# Altium project Tube02.PrjPCB
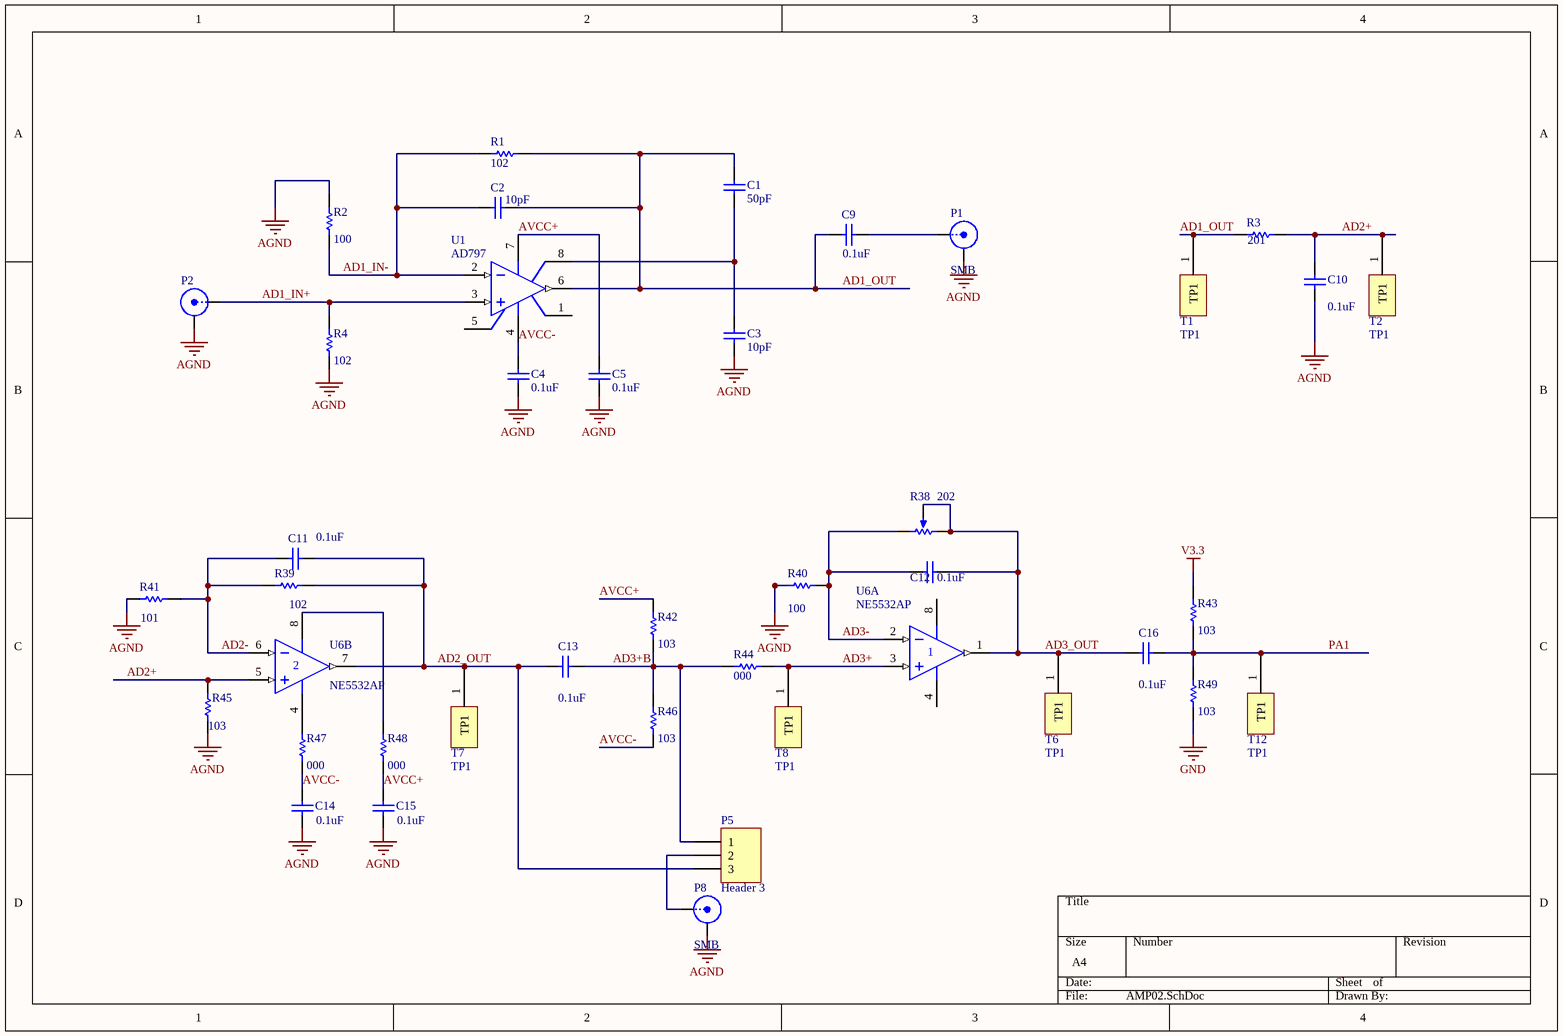
[diagram p0: AMP02.SchDoc]
4 sheets, 102 parts. Net scope: global (net labels, ports and power ports of the same name join across sheets).
Board file: Tube02.PcbDoc
Sheets:
  AMP02.SchDoc
  Commu02.SchDoc
  MCU02.SchDoc
  Power02.SchDoc

## Sheet AMP02.SchDoc
size A4

### Parts
C1  value 50pF  [1206]  (hidden comment: Cap Semi)
C2  value 10pF  [1206]  (hidden comment: Cap Semi)
C3  value 10pF  [1206]  (hidden comment: Cap Semi)
C4  value 0.1uF  [1206]  (hidden comment: Cap Semi)
C5  value 0.1uF  [1206]  (hidden comment: Cap Semi)
C9  value 0.1uF  [1206]  (hidden comment: Cap Semi)
C10  value 0.1uF  [1206]  (hidden comment: Cap Semi)
C11  value 0.1uF  [1206]  (hidden comment: Cap Semi)
C12  value 0.1uF  [1206]  (hidden comment: Cap Semi)
C13  value 0.1uF  [1206]  (hidden comment: Cap Semi)
C14  value 0.1uF  [1206]  (hidden comment: Cap Semi)
C15  value 0.1uF  [1206]  (hidden comment: Cap Semi)
C16  value 0.1uF  [1206]  (hidden comment: Cap Semi)
P1  SMB  [SMB_V-RJ45]
P2  SMB  [SMB_V-RJ45]  (value not drawn)
P5  Header 3  [HDR1X3]
P8  SMB  [SMB_V-RJ45]
R1  value 102  [1206]  (hidden comment: Res Semi)
R2  value 100  [1206]  (hidden comment: Res Semi)
R3  value 201  [1206]  (hidden comment: Res Semi)
R4  value 102  [1206]  (hidden comment: Res Semi)
R38  value 202  [VR5]  (hidden comment: RPot)
R39  value 102  [1206]  (hidden comment: Res Semi)
R40  value 100  [1206]  (hidden comment: Res Semi)
R41  value 101  [1206]  (hidden comment: Res Semi)
R42  value 103  [1206]  (hidden comment: Res Semi)
R43  value 103  [1206]  (hidden comment: Res Semi)
R44  value 000  [1206]  (hidden comment: Res Semi)
R45  value 103  [1206]  (hidden comment: Res Semi)
R46  value 103  [1206]  (hidden comment: Res Semi)
R47  value 000  [1206]  (hidden comment: Res Semi)
R48  value 000  [1206]  (hidden comment: Res Semi)
R49  value 103  [1206]  (hidden comment: Res Semi)
T1  TP1  [TP1]
T2  TP1  [TP1]
T6  TP1  [TP1]
T7  TP1  [TP1]
T8  TP1  [TP1]
T12  TP1  [TP1]
U1  AD797  [SO-8C_M]
U6  NE5532AP  [SO-8C_M]  (parts A,B of 2)

### Nets
AGND: C3.1 C4.1 C5.1 C10.1 C14.1 C15.1 P1.2(Y) P2.2(Y) P8.2(Y) R2.2 R4.1 R40.1 R41.1 R45.1
GND: R49.1
V3.3: R43.2
AD1_IN+: P2.1(X) R4.2 U1.3(IN+)
AD1_IN-: C2.1 R1.2 R2.1 U1.2(IN-)
AD1_OUT: C1.2 C2.2 C9.1 R1.1 R3.1 T1.1(TP1) U1.6(OUT)
AD2+: C10.2 R3.2 R45.2 T2.1(TP1) U6.5(IN+)
AD2-: C11.1 R39.1 R41.2 U6.6(IN-)
AD2_OUT: C11.2 C13.1 P5.3 R39.2 T7.1(TP1) U6.7(OUT)
AD3+: R44.1 T8.1(TP1) U6.3(IN+)
AD3+B: C13.2 P5.1 R42.1 R44.2 R46.2
AD3-: C12.1 R38.2(BOT) R40.2 U6.2(IN-)
AD3_OUT: C12.2 C16.1 R38.1(TOP) R38.3(TAP) T6.1(TP1) U6.1(OUT)
AVCC+: C5.2 C15.2 R42.2 R48.1 U1.7(V+)
AVCC-: C4.2 C14.2 R46.1 R47.1 U1.4(V-)
PA1: C16.2 R43.1 R49.2 T12.1(TP1)
NetC1_1: C1.1 C3.2 U1.8(DECMPEN)
NetC9_2: C9.2 P1.1(X)
NetP5_2: P5.2 P8.1(X)
NetR47_2: R47.2 U6.4(V-)
NetR48_2: R48.2 U6.8(V+)

Not connected (* = marked no-connect by the designer): U1 1(OS_NUL) 5(OS_NUL)

### Library data of the parts
C1-C5 C9-C16 = Cap Semi: Capacitor (Semiconductor SIM Model); Published: 8-Jun-2000; LatestRevisionDate: 29-May-2009; LatestRevisionNote: IPC-7351 Footprint Added.; PackageReference: C1206; Publisher: Altium Limited; PackageDescription: Chip Capacitor
P1 P2 P8 = SMB: SMB Straight Connector; LatestRevisionDate: 17-Jul-2002; LatestRevisionNote: Re-released for DXP Platform.; Publisher: Altium Limited
P5 = Header 3: Header, 3-Pin; LatestRevisionDate: 17-Jul-2002; LatestRevisionNote: Re-released for DXP Platform.; Publisher: Altium Limited
R1-R4 R39-R49 = Res Semi: Semiconductor Resistor; Published: 8-Jun-2000; LatestRevisionDate: 17-Jul-2002; LatestRevisionNote: Re-released for DXP Platform.; PackageReference: AXIAL-0.5; Publisher: Altium Limited
R38 = RPot: Potentiometer; Sim Note: Enter the Resistance value and the set point into parameter fields.; Set Position: 0.5; Published: 8-Jun-2000; LatestRevisionDate: 17-Jul-2002; LatestRevisionNote: Re-released for DXP Platform.; PackageReference: VR5; Publisher: Altium Limited
U1 = AD797AR: Ultra-Low Distortion, Ultra-Low Noise Operational Amplifier; Published: 8-Jun-2000; LatestRevisionDate: 13-Apr-2006; LatestRevisionNote: IPC-7351 Footprint Added.; DatasheetVersion: REV. C; PackageVersion: revC; PackageReference: SO-8C; Publisher: Altium Limited; PackageDescription: 8-Pin Small Outline Integrated Circuit 1.27 mm Pitch; Code_IPC: SOIC127P600-8; ComponentLink1Description: Manufacturer Link; ComponentLink1URL: http://www.analog.com/en/prod/0,,759_786_AD797%2C00.html; ComponentLink2Description: Datasheet; ComponentLink2URL: http://www.analog.com/UploadedFiles/Data_Sheets/507345751AD797_d.pdf
U6 = NE5532AP: Dual Low-Noise Operational Amplifier; Published: 15-Apr-2002; LatestRevisionDate: 04-Mar-2005; LatestRevisionNote: Stylized 3D Model Added.; DatasheetVersion: May-1988; PackageVersion: Jun-1999; PackageReference: P008; Publisher: Altium Limited; PackageDescription: DIP; 8 Leads; Row Spacing 7.62 mm; Pitch 2.54 mm; Code_JEDEC: MO-001-AN; ComponentLink1Description: Manufacturer Link; ComponentLink1URL: http://www.ti.com/; ComponentLink2Description: Datasheet; ComponentLink2URL: http://www-s.ti.com/sc/ds/ne5532a.pdf

## Sheet Commu02.SchDoc
size A4
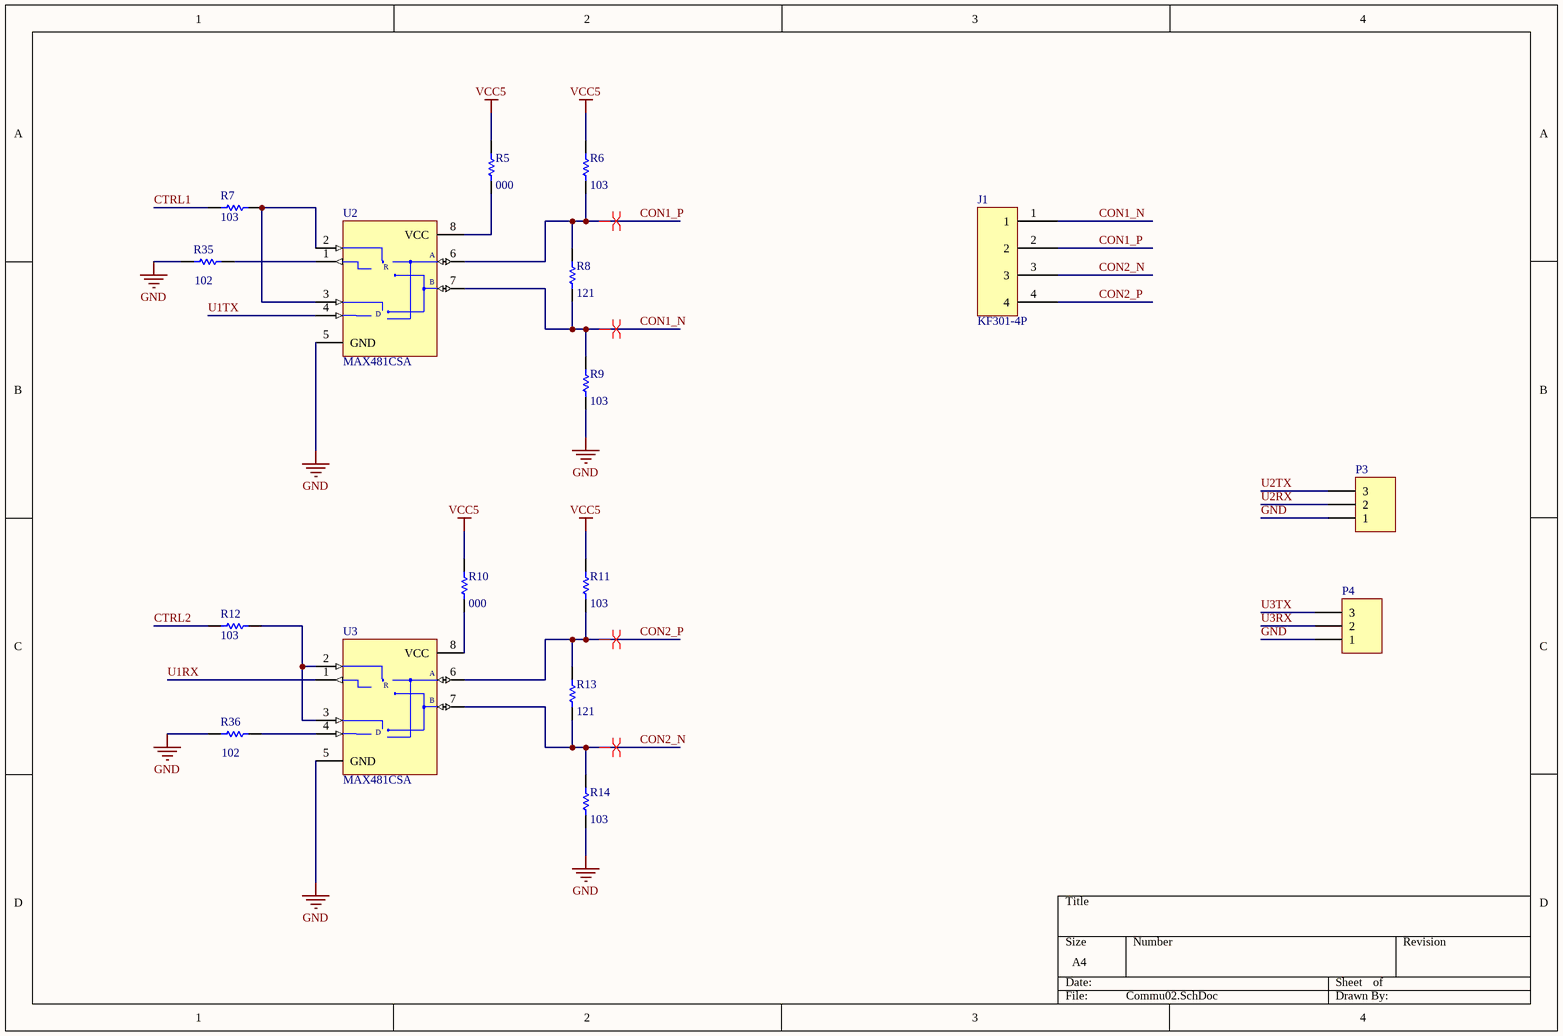
[diagram p1: Commu02.SchDoc]

### Parts
J1  KF301-4P  [KF301-4P]
P3  Header 3  [HDR1X3]  (value not drawn)
P4  Header 3  [HDR1X3]  (value not drawn)
R5  value 000  [1206]  (hidden comment: Res Semi)
R6  value 103  [1206]  (hidden comment: Res Semi)
R7  value 103  [1206]  (hidden comment: Res Semi)
R8  value 121  [1206]  (hidden comment: Res Semi)
R9  value 103  [1206]  (hidden comment: Res Semi)
R10  value 000  [1206]  (hidden comment: Res Semi)
R11  value 103  [1206]  (hidden comment: Res Semi)
R12  value 103  [1206]  (hidden comment: Res Semi)
R13  value 121  [1206]  (hidden comment: Res Semi)
R14  value 103  [1206]  (hidden comment: Res Semi)
R35  value 102  [1206]  (hidden comment: Res Semi)
R36  value 102  [1206]  (hidden comment: Res Semi)
U2  MAX481CSA  [NSO8_M]
U3  MAX481CSA  [NSO8_M]

### Nets
GND: P3.1 P4.1 R9.1 R14.1 R35.2 R36.2 U2.5(GND) U3.5(GND)
VCC5: R5.2 R6.2 R10.2 R11.2
CON1_N: J1.1 R8.1 R9.2 U2.7(B)
CON1_P: J1.2 R6.1 R8.2 U2.6(A)
CON2_N: J1.3 R13.1 R14.2 U3.7(B)
CON2_P: J1.4 R11.1 R13.2 U3.6(A)
CTRL1: R7.2
CTRL2: R12.2
U1RX: U3.1(RO)
U1TX: U2.4(DI)
U2RX: P3.2
U2TX: P3.3
U3RX: P4.2
U3TX: P4.3
NetR5_1: R5.1 U2.8(VCC)
NetR7_1: R7.1 U2.2(~{RE}) U2.3(DE)
NetR10_1: R10.1 U3.8(VCC)
NetR12_1: R12.1 U3.2(~{RE}) U3.3(DE)
NetR35_1: R35.1 U2.1(RO)
NetR36_1: R36.1 U3.4(DI)

### Layout directives
differential pair: CON1_N, CON1_P, CON2_N, CON2_P

### Notes on the sheet
- (in symbol MAX481CSA) R; D

### Library data of the parts
P3 P4 = Header 3: Header, 3-Pin; LatestRevisionDate: 17-Jul-2002; LatestRevisionNote: Re-released for DXP Platform.; Publisher: Altium Limited
R5-R14 R35 R36 = Res Semi: Semiconductor Resistor; Published: 8-Jun-2000; LatestRevisionDate: 17-Jul-2002; LatestRevisionNote: Re-released for DXP Platform.; PackageReference: AXIAL-0.5; Publisher: Altium Limited
U2 U3 = MAX481CSA: Low-Power, Slew-Rate-Limited RS-485/RS-422 Transceiver; Published: 16-Jan-2001; LatestRevisionDate: 13-Apr-2006; LatestRevisionNote: IPC-7351 Footprint Added.; DatasheetVersion: Feb-1996; PackageReference: NSO8; Publisher: Altium Limited; PackageDescription: 8-Pin Small Outline Integrated Circuit 1.27 mm Pitch; Code_JEDEC: MS-012-AA; Code_IPC: SOIC127P600-8; ComponentLink1Description: Manufacturer Link; ComponentLink1URL: http://www.maxim-ic.com/; ComponentLink2Description: Datasheet; ComponentLink2URL: http://pdfserv.maxim-ic.com/en/ds/MAX1487-MAX491.pdf

## Sheet MCU02.SchDoc
size A4
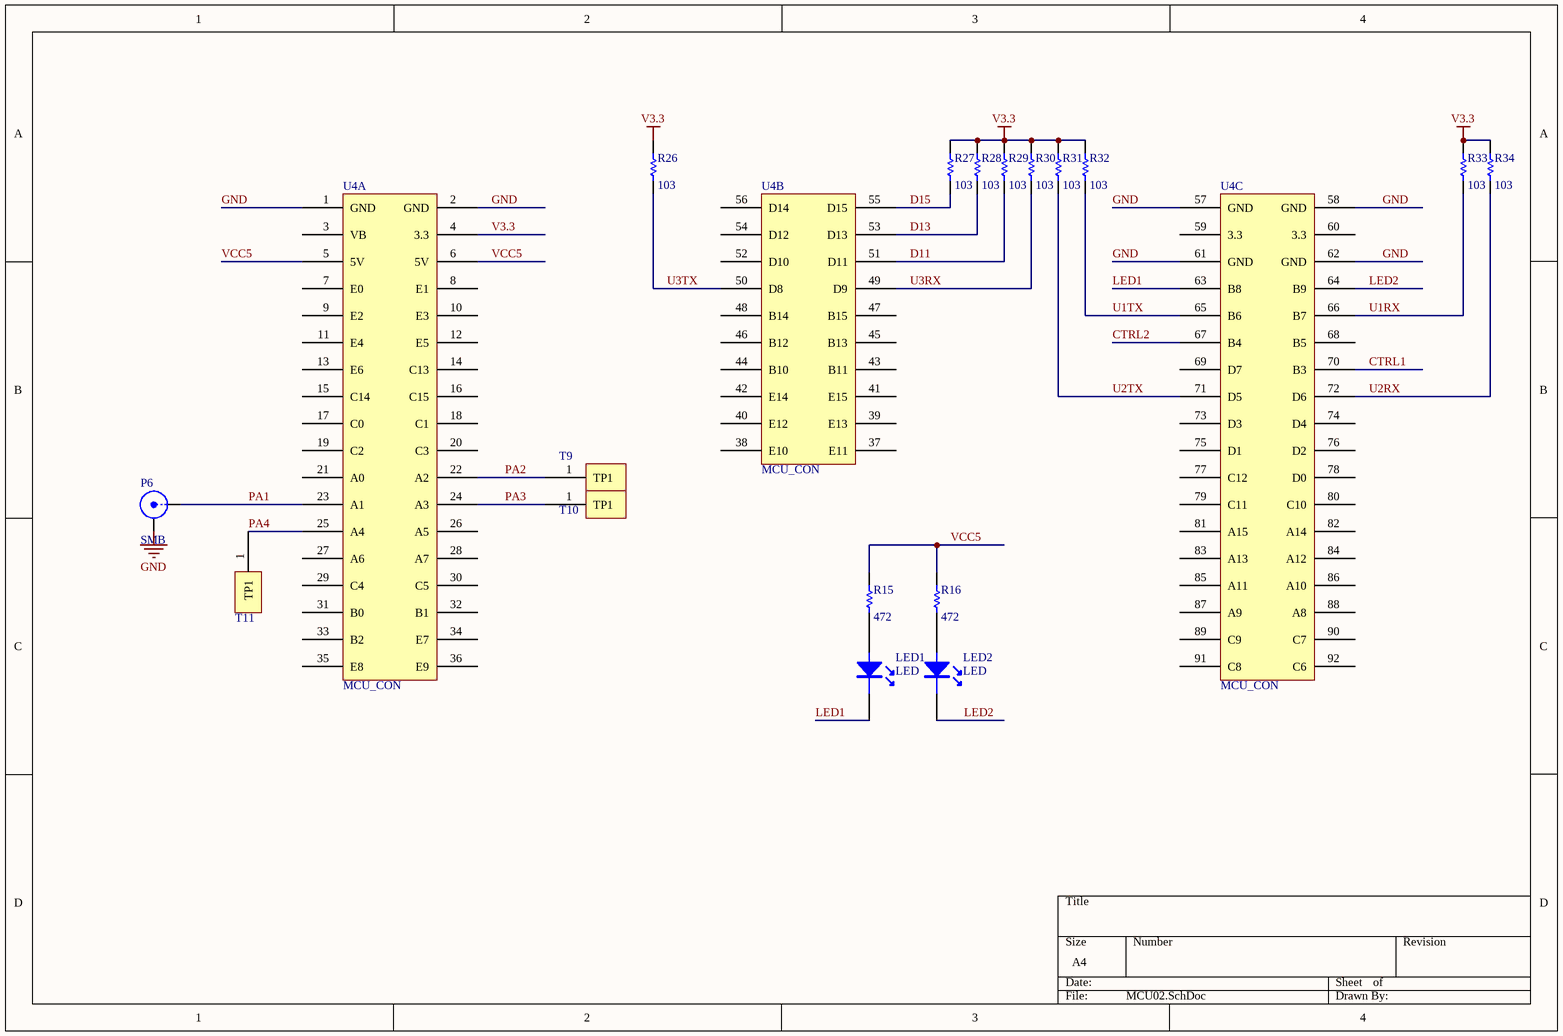
[diagram p2: MCU02.SchDoc]

### Parts
LED1  LED  [0805_LED]
LED2  LED  [0805_LED]
P6  SMB  [SMB_V-RJ45]
R15  value 472  [1206]  (hidden comment: Res Semi)
R16  value 472  [1206]  (hidden comment: Res Semi)
R26  value 103  [1206]  (hidden comment: Res Semi)
R27  value 103  [1206]  (hidden comment: Res Semi)
R28  value 103  [1206]  (hidden comment: Res Semi)
R29  value 103  [1206]  (hidden comment: Res Semi)
R30  value 103  [1206]  (hidden comment: Res Semi)
R31  value 103  [1206]  (hidden comment: Res Semi)
R32  value 103  [1206]  (hidden comment: Res Semi)
R33  value 103  [1206]  (hidden comment: Res Semi)
R34  value 103  [1206]  (hidden comment: Res Semi)
T9  TP1  [TP1]  (value not drawn)
T10  TP1  [TP1]  (value not drawn)
T11  TP1  [TP1]  (value not drawn)
U4  MCU_CON  [MCU_CON]  (parts A,B,C of 3)

### Nets
GND: P6.2(Y) U4.1(GND) U4.2(GND) U4.57(GND) U4.58(GND) U4.61(GND) U4.62(GND)
V3.3: R26.2 R27.2 R28.2 R29.2 R30.2 R31.2 R32.2 R33.2 R34.2 U4.4(3.3)
VCC5: R15.2 R16.2 U4.5(5V) U4.6(5V)
CTRL1: U4.70(B3)
CTRL2: U4.67(B4)
D11: R29.1 U4.51(D11)
D13: R28.1 U4.53(D13)
D15: R27.1 U4.55(D15)
LED1: LED1.2(K) U4.63(B8)
LED2: LED2.2(K) U4.64(B9)
PA1: P6.1(X) U4.23(A1)
PA2: T9.1(TP1) U4.22(A2)
PA3: T10.1(TP1) U4.24(A3)
PA4: T11.1(TP1) U4.25(A4)
U1RX: R33.1 U4.66(B7)
U1TX: R32.1 U4.65(B6)
U2RX: R34.1 U4.72(D6)
U2TX: R31.1 U4.71(D5)
U3RX: R30.1 U4.49(D9)
U3TX: R26.1 U4.50(D8)
NetLED1_1: LED1.1(A) R15.1
NetLED2_1: LED2.1(A) R16.1

Not connected (* = marked no-connect by the designer): U4 3(VB) 7(E0) 8(E1) 9(E2) 10(E3) 11(E4) 12(E5) 13(E6) 14(C13) 15(C14) 16(C15) 17(C0) 18(C1) 19(C2) 20(C3) 21(A0) 26(A5) 27(A6) 28(A7) 29(C4) 30(C5) 31(B0) 32(B1) 33(B2) 34(E7) 35(E8) 36(E9) 37(E11) 38(E10) 39(E13) 40(E12) 41(E15) 42(E14) 43(B11) 44(B10) 45(B13) 46(B12) 47(B15) 48(B14) 52(D10) 54(D12) 56(D14) 59(3.3) 60(3.3) 68(B5) 69(D7) 73(D3) 74(D4) 75(D1) 76(D2) 77(C12) 78(D0) 79(C11) 80(C10) 81(A15) 82(A14) 83(A13) 84(A12) 85(A11) 86(A10) 87(A9) 88(A8) 89(C9) 90(C7) 91(C8) 92(C6)

### Library data of the parts
P6 = SMB: SMB Straight Connector; LatestRevisionDate: 17-Jul-2002; LatestRevisionNote: Re-released for DXP Platform.; Publisher: Altium Limited
R15 R16 R26-R34 = Res Semi: Semiconductor Resistor; Published: 8-Jun-2000; LatestRevisionDate: 17-Jul-2002; LatestRevisionNote: Re-released for DXP Platform.; PackageReference: AXIAL-0.5; Publisher: Altium Limited

## Sheet Power02.SchDoc
size A4
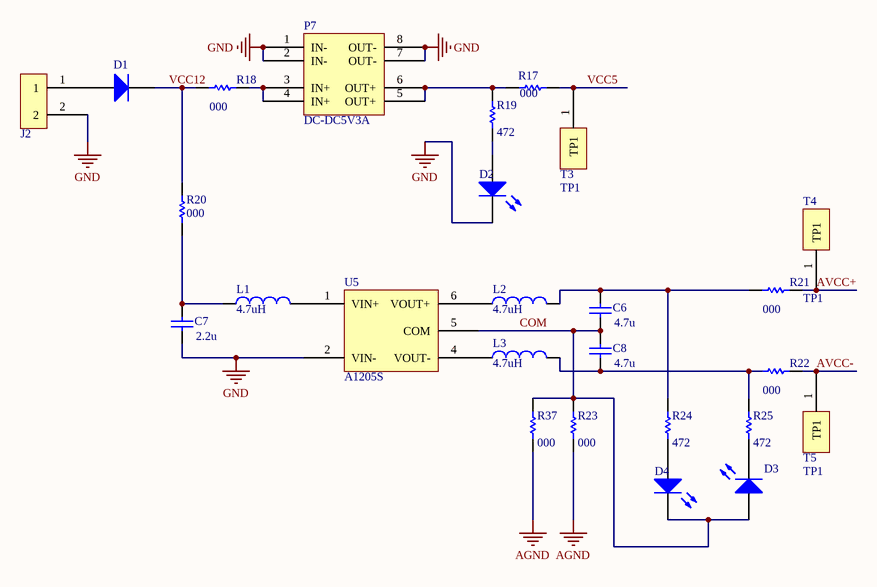
[diagram p3: Power02.SchDoc]

### Parts
C6  value 4.7u  [1206]  (hidden comment: Cap Semi)
C7  value 2.2u  [1206]  (hidden comment: Cap Semi)
C8  value 4.7u  [1206]  (hidden comment: Cap Semi)
D1  LED2  [0805_LED]  (value not drawn)
D2  LED2  [0805_LED]  (value not drawn)
D3  LED2  [0805_LED]  (value not drawn)
D4  LED2  [0805_LED]  (value not drawn)
J2  XK7.62-2P  [XK7.62-2P]  (value not drawn)
L1  value 4.7uH  [1206]  (hidden comment: Inductor)
L2  value 4.7uH  [1206]  (hidden comment: Inductor)
L3  value 4.7uH  [1206]  (hidden comment: Inductor)
P7  DC-DC5V3A  [DC-DC3A]
R17  value 000  [1206]  (hidden comment: Res Semi)
R18  value 000  [1206]  (hidden comment: Res Semi)
R19  value 472  [1206]  (hidden comment: Res Semi)
R20  value 000  [1206]  (hidden comment: Res Semi)
R21  value 000  [1206]  (hidden comment: Res Semi)
R22  value 000  [1206]  (hidden comment: Res Semi)
R23  value 000  [1206]  (hidden comment: Res Semi)
R24  value 472  [1206]  (hidden comment: Res Semi)
R25  value 472  [1206]  (hidden comment: Res Semi)
R37  value 000  [1206]  (hidden comment: Res Semi)
T3  TP1  [TP1]
T4  TP1  [TP1]
T5  TP1  [TP1]
U5  A1205S  [A1205S]

### Nets
AGND: R23.1 R37.1
GND: C7.1 D2.2(K) J2.2 P7.1(IN-) P7.2(IN-) P7.7(OUT-) P7.8(OUT-) U5.2(VIN-)
VCC5: R17.2 T3.1(TP1)
AVCC+: R21.2 T4.1(TP1)
AVCC-: R22.2 T5.1(TP1)
COM: C6.1 C8.2 D3.1(A) D4.2(K) R23.2 R37.2 U5.5(COM)
VCC12: D1.2(K) R18.1 R20.2
NetC6_2: C6.2 L2.2 R21.1 R24.2
NetC7_2: C7.2 L1.1 R20.1
NetC8_1: C8.1 L3.2 R22.1 R25.2
NetD1_1: D1.1(A) J2.1
NetD2_1: D2.1(A) R19.1
NetD3_2: D3.2(K) R25.1
NetD4_1: D4.1(A) R24.1
NetL1_2: L1.2 U5.1(VIN+)
NetL2_1: L2.1 U5.6(VOUT+)
NetL3_1: L3.1 U5.4(VOUT-)
NetP7_3: P7.3(IN+) P7.4(IN+) R18.2
NetP7_5: P7.5(OUT+) P7.6(OUT+) R17.1 R19.2

### Library data of the parts
C6-C8 = Cap Semi: Capacitor (Semiconductor SIM Model); Published: 8-Jun-2000; LatestRevisionDate: 29-May-2009; LatestRevisionNote: IPC-7351 Footprint Added.; PackageReference: C1206; Publisher: Altium Limited; PackageDescription: Chip Capacitor
D1 = Diode 1N4001: 1 Amp General Purpose Rectifier; Published: 8-Jun-2000; LatestRevisionDate: 17-Jul-2002; LatestRevisionNote: Re-released for DXP Platform.; DatasheetVersion: 1998; PackageVersion: Aug-1999; PackageReference: DO-41; Publisher: Altium Limited; Code_JEDEC: DO-204-AL; ComponentLink1Description: Manufacturer Link; ComponentLink1URL: http://www.fairchildsemi.com/; ComponentLink2Description: Datasheet; ComponentLink2URL: http://www.fairchildsemi.com/ds/1N%2F1N4001.pdf
D2-D4 = LED2: Typical RED, GREEN, YELLOW, AMBER GaAs LED; Published: 8-Jun-2000; LatestRevisionDate: 17-Jul-2002; LatestRevisionNote: Re-released for DXP Platform.; PackageVersion: Feb-2002; PackageReference: 3.2X1.6X1.1; Publisher: Altium Limited
L1-L3 = Inductor: Code_IEC: 1005; Published: 8-Jun-2000; LatestRevisionDate: 29-May-2009; LatestRevisionNote: IPC-7351 Footprint Added.; PackageReference: 0402-A; Publisher: Altium Limited; PackageDescription: Chip Inductor; Code_JEITA: 0402
P7 = DC-DC3A
R17-R25 R37 = Res Semi: Semiconductor Resistor; Published: 8-Jun-2000; LatestRevisionDate: 17-Jul-2002; LatestRevisionNote: Re-released for DXP Platform.; PackageReference: AXIAL-0.5; Publisher: Altium Limited

## Nets that join several sheets
AGND: AMP02 (14 pins), Power02 (R23.1 R37.1)
GND: AMP02 (R49.1), Commu02 (8 pins), MCU02 (7 pins), Power02 (8 pins)
V3.3: AMP02 (R43.2), MCU02 (10 pins)
VCC5: Commu02 (R5.2 R6.2 R10.2 R11.2), MCU02 (R15.2 R16.2 U4.5 U4.6), Power02 (R17.2 T3.1)
AVCC+: AMP02 (5 pins), Power02 (R21.2 T4.1)
AVCC-: AMP02 (5 pins), Power02 (R22.2 T5.1)
CTRL1: Commu02 (R7.2), MCU02 (U4.70)
CTRL2: Commu02 (R12.2), MCU02 (U4.67)
PA1: AMP02 (C16.2 R43.1 R49.2 T12.1), MCU02 (P6.1 U4.23)
U1RX: Commu02 (U3.1), MCU02 (R33.1 U4.66)
U1TX: Commu02 (U2.4), MCU02 (R32.1 U4.65)
U2RX: Commu02 (P3.2), MCU02 (R34.1 U4.72)
U2TX: Commu02 (P3.3), MCU02 (R31.1 U4.71)
U3RX: Commu02 (P4.2), MCU02 (R30.1 U4.49)
U3TX: Commu02 (P4.3), MCU02 (R26.1 U4.50)